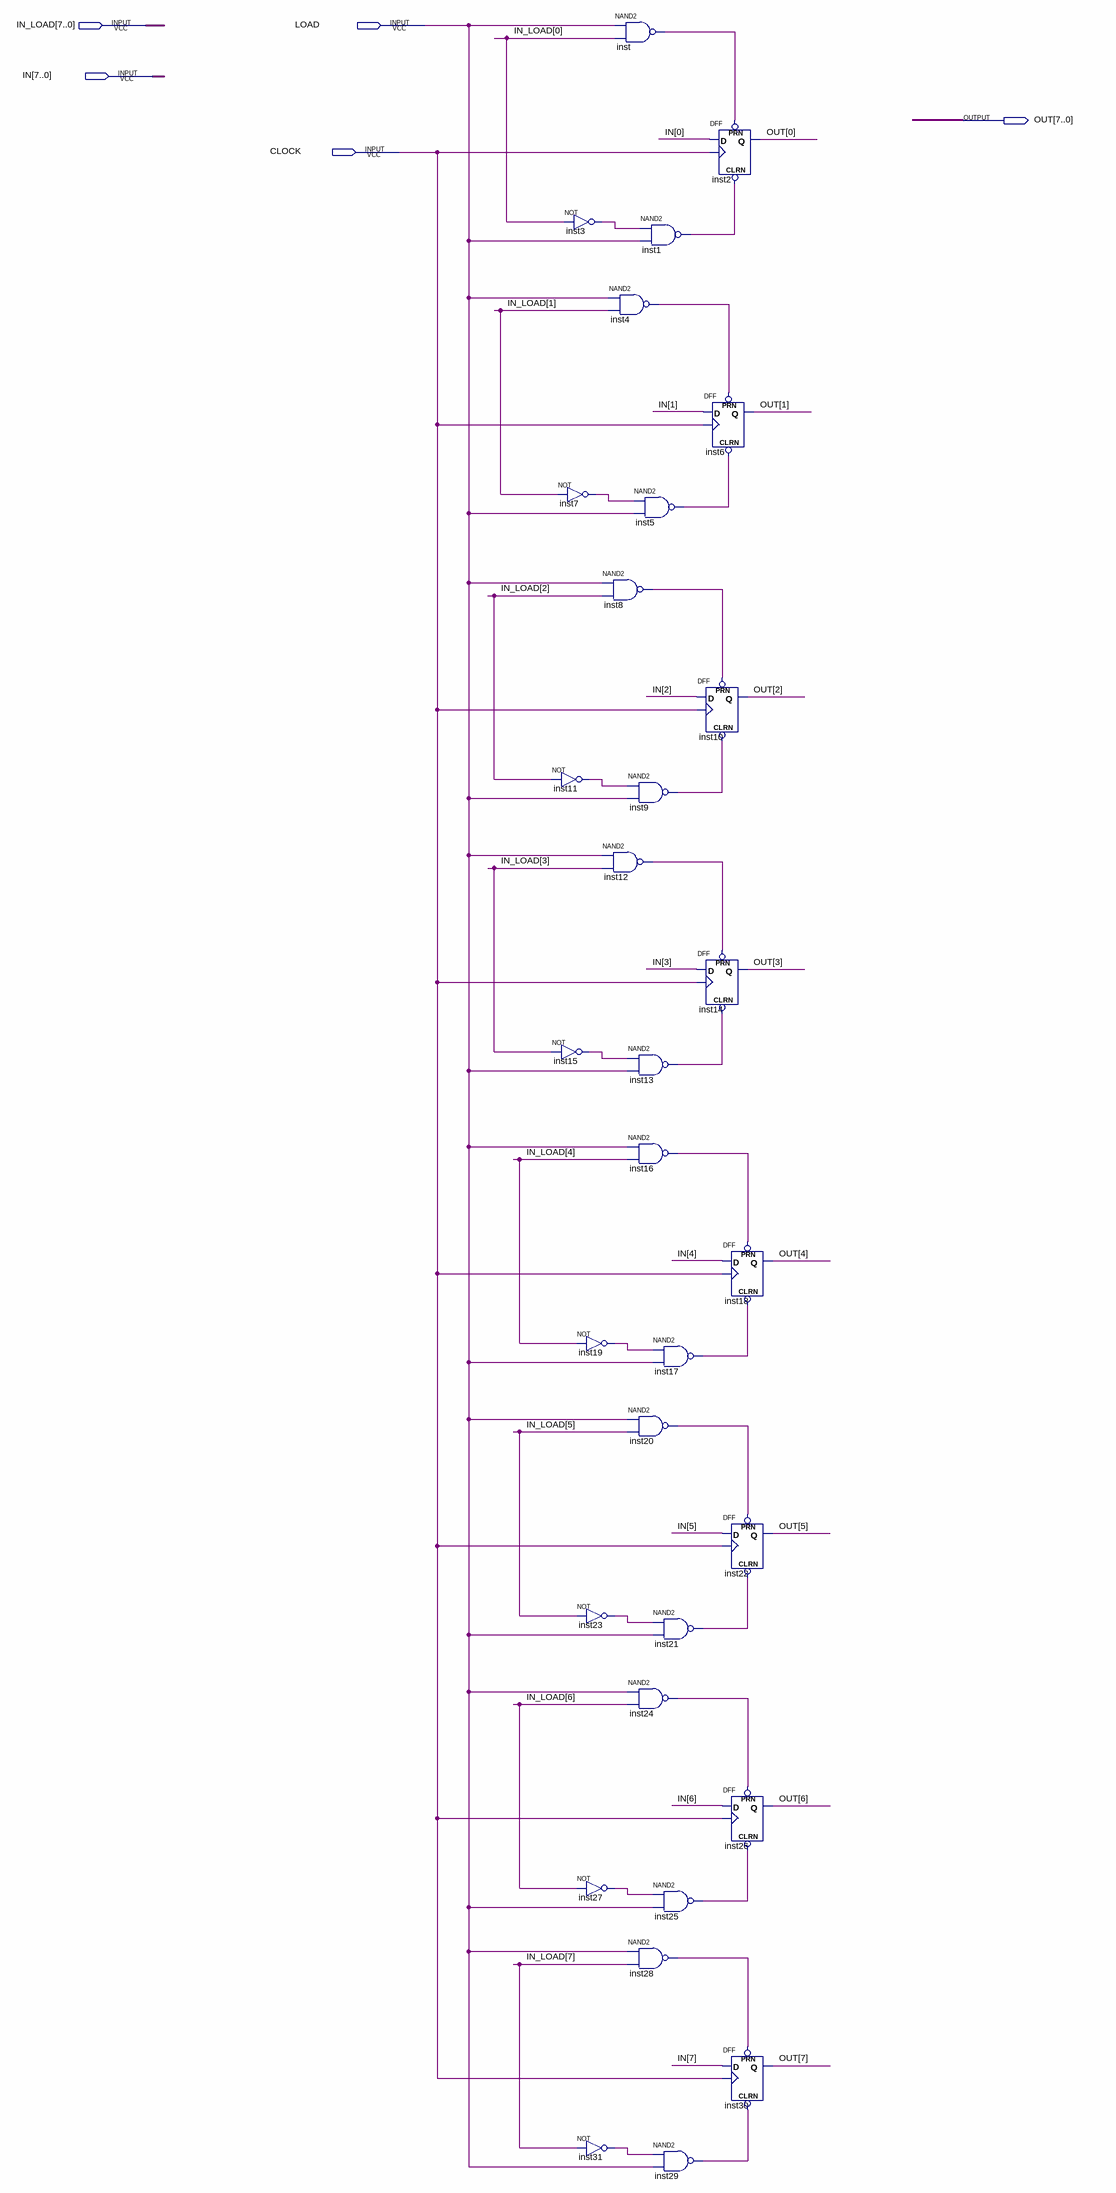
[diagram p0: schematic sheet]
// Quartus schematic REGISTER_8bit.bdf as structural Verilog: 32 symbols, 5 pins
module REGISTER_8bit (
  input  [7:0] IN_LOAD,
  input  LOAD,
  input  [7:0] IN,
  input  CLOCK,
  output [7:0] OUT
);

  wire inst1_out, inst3_out, inst4_out, inst5_out, inst7_out, inst8_out, inst9_out, inst11_out, inst12_out,
       inst13_out, inst15_out, inst16_out, inst17_out, inst19_out, inst20_out, inst21_out, inst23_out,
       inst24_out, inst25_out, inst27_out, inst28_out, inst29_out, inst31_out, inst_out;

  not inst3 (inst3_out, IN_LOAD[0]);
  not inst7 (inst7_out, IN_LOAD[1]);
  not inst11 (inst11_out, IN_LOAD[2]);
  not inst15 (inst15_out, IN_LOAD[3]);
  nand inst (inst_out, LOAD, IN_LOAD[0]);
  nand inst4 (inst4_out, LOAD, IN_LOAD[1]);
  nand inst8 (inst8_out, LOAD, IN_LOAD[2]);
  nand inst12 (inst12_out, LOAD, IN_LOAD[3]);
  not inst19 (inst19_out, IN_LOAD[4]);
  not inst23 (inst23_out, IN_LOAD[5]);
  not inst27 (inst27_out, IN_LOAD[6]);
  not inst31 (inst31_out, IN_LOAD[7]);
  nand inst1 (inst1_out, inst3_out, LOAD);
  nand inst5 (inst5_out, inst7_out, LOAD);
  nand inst9 (inst9_out, inst11_out, LOAD);
  nand inst13 (inst13_out, inst15_out, LOAD);
  nand inst16 (inst16_out, LOAD, IN_LOAD[4]);
  nand inst17 (inst17_out, inst19_out, LOAD);
  nand inst20 (inst20_out, LOAD, IN_LOAD[5]);
  nand inst21 (inst21_out, inst23_out, LOAD);
  nand inst24 (inst24_out, LOAD, IN_LOAD[6]);
  nand inst25 (inst25_out, inst27_out, LOAD);
  nand inst28 (inst28_out, LOAD, IN_LOAD[7]);
  nand inst29 (inst29_out, inst31_out, LOAD);
  DFF inst2 (.CLRN(inst1_out), .CLK(CLOCK), .D(IN[0]), .PRN(inst_out), .Q(OUT[0]));
  DFF inst6 (.CLRN(inst5_out), .CLK(CLOCK), .D(IN[1]), .PRN(inst4_out), .Q(OUT[1]));
  DFF inst10 (.CLRN(inst9_out), .CLK(CLOCK), .D(IN[2]), .PRN(inst8_out), .Q(OUT[2]));
  DFF inst14 (.CLRN(inst13_out), .CLK(CLOCK), .D(IN[3]), .PRN(inst12_out), .Q(OUT[3]));
  DFF inst18 (.CLRN(inst17_out), .CLK(CLOCK), .D(IN[4]), .PRN(inst16_out), .Q(OUT[4]));
  DFF inst22 (.CLRN(inst21_out), .CLK(CLOCK), .D(IN[5]), .PRN(inst20_out), .Q(OUT[5]));
  DFF inst26 (.CLRN(inst25_out), .CLK(CLOCK), .D(IN[6]), .PRN(inst24_out), .Q(OUT[6]));
  DFF inst30 (.CLRN(inst29_out), .CLK(CLOCK), .D(IN[7]), .PRN(inst28_out), .Q(OUT[7]));
endmodule
